# EAGLE design MainControll (EAGLE 9.6.2)
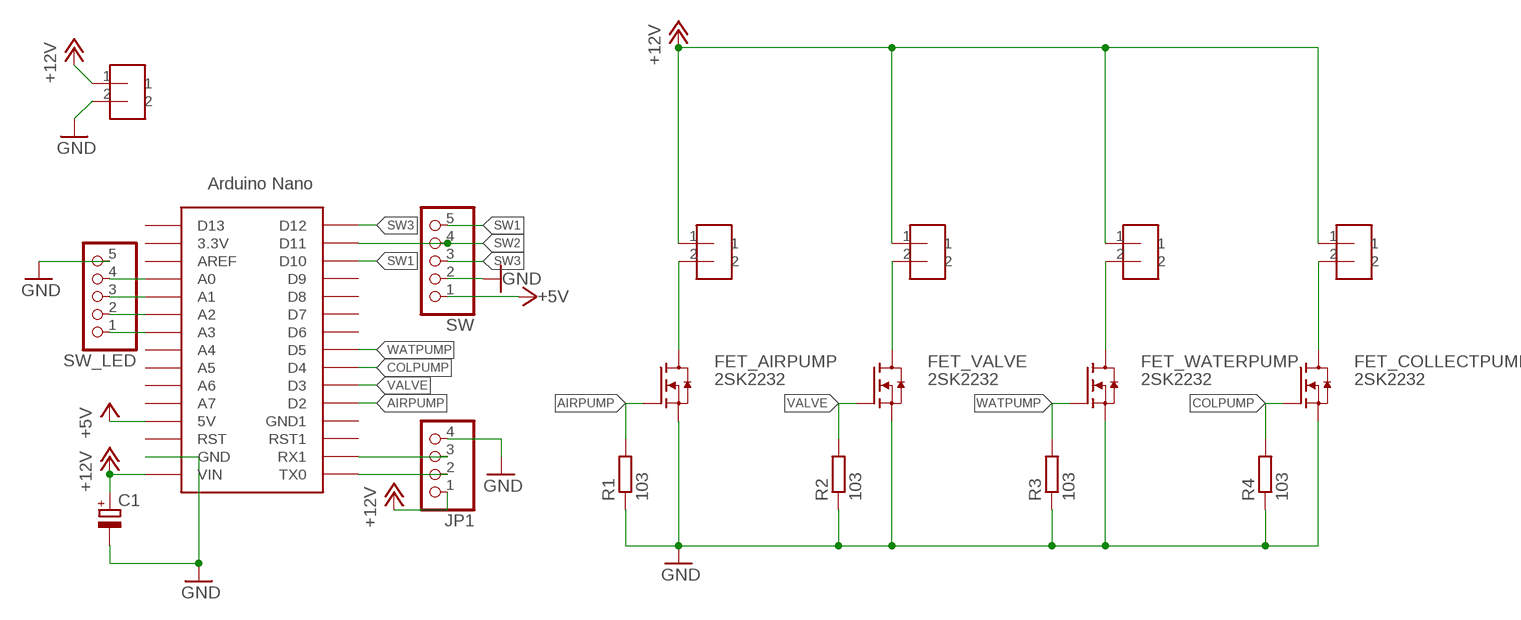
[diagram p0: schematic, sheet 1]

## Parts
C1  CPOL-EUE2.5-5  [E2,5-5]
FET_AIRPUMP  2SK2232  [TO220]
FET_COLLECTPUMP  2SK2232  [TO220]
FET_VALVE  2SK2232  [TO220]
FET_WATERPUMP  2SK2232  [TO220]
JP1  PINHD-1X4  [1X04]
R1  103  R-EU_0204/5  [0204/5]
R2  103  R-EU_0204/5  [0204/5]
R3  103  R-EU_0204/5  [0204/5]
R4  103  R-EU_0204/5  [0204/5]
SW  PINHD-1X5  [1X05]
SW_LED  PINHD-1X5  [1X05]
TERMINAL_AIRPUMP  TERMINAL_BLOCK_5.08MM  [TERMINAL_BLOCK_5.8MM]
TERMINAL_COLLECTPUMP  TERMINAL_BLOCK_5.08MM  [TERMINAL_BLOCK_5.8MM]
TERMINAL_VALVE  TERMINAL_BLOCK_5.08MM  [TERMINAL_BLOCK_5.8MM]
TERMINAL_WATERPUMP  TERMINAL_BLOCK_5.08MM  [TERMINAL_BLOCK_5.8MM]
U$1  TERMINAL_BLOCK_5.08MM  [TERMINAL_BLOCK_5.8MM]
U$2  NANO_DIL_RECEPTOR  [NANO_DIL]

## Nets
+5V: SW.1 U$2.5V
+12V [vcc_gnd]: C1.+ JP1.1 TERMINAL_AIRPUMP.1 TERMINAL_COLLECTPUMP.1 TERMINAL_VALVE.1 TERMINAL_WATERPUMP.1 U$1.1 U$2.VIN
AIRPUMP: FET_AIRPUMP.1(G) R1.2 U$2.D2
COLPUMP: FET_COLLECTPUMP.1(G) R4.2 U$2.D4
GND [vcc_gnd]: C1.- FET_AIRPUMP.3(S) FET_COLLECTPUMP.3(S) FET_VALVE.3(S) FET_WATERPUMP.3(S) JP1.4 R1.1 R2.1 R3.1 R4.1 SW.2 SW_LED.5 U$1.2 U$2.GND
N$1: JP1.3 U$2.RX1
N$2: JP1.2 U$2.TX0
N$7: FET_AIRPUMP.2(D) TERMINAL_AIRPUMP.2
N$8: FET_VALVE.2(D) TERMINAL_VALVE.2
N$9: FET_WATERPUMP.2(D) TERMINAL_WATERPUMP.2
N$10: FET_COLLECTPUMP.2(D) TERMINAL_COLLECTPUMP.2
N$11: SW_LED.4 U$2.A0
N$12: SW_LED.3 U$2.A1
N$13: SW_LED.2 U$2.A2
N$14: SW_LED.1 U$2.A3
SW1: SW.5 U$2.D10
SW2: SW.4 U$2.D11
SW3: SW.3 U$2.D12
VALVE: FET_VALVE.1(G) R2.2 U$2.D3
WATPUMP: FET_WATERPUMP.1(G) R3.2 U$2.D5
Unconnected: U$2.3.3V U$2.A4 U$2.A5 U$2.A6 U$2.A7 U$2.AREF U$2.D6 U$2.D7 U$2.D8 U$2.D9 U$2.D13 U$2.GND1 U$2.RST U$2.RST1

## Library data of the parts
C1 = rcl:CPOL-EU: POLARIZED CAPACITOR, European symbol; SPICEPREFIX: C
FET_AIRPUMP FET_COLLECTPUMP FET_VALVE FET_WATERPUMP = Transistor-FET:2SK2232
JP1 = pinhead:PINHD-1X4: PIN HEADER
R1-R4 = rcl:R-EU_: RESISTOR, European symbol; SPICEPREFIX: R
SW SW_LED = pinhead:PINHD-1X5: PIN HEADER
TERMINAL_AIRPUMP TERMINAL_COLLECTPUMP TERMINAL_VALVE TERMINAL_WATERPUMP U$1 = terminal_block_5.08mm:TERMINAL_BLOCK_5.08MM
U$2 = Arduino-clone:NANO_DIL_RECEPTOR

## Net classes
0 default: width 0.152 mm, clearance 0.305 mm
1 vcc_gnd: width 0.406 mm, clearance 0.305 mm

## Board
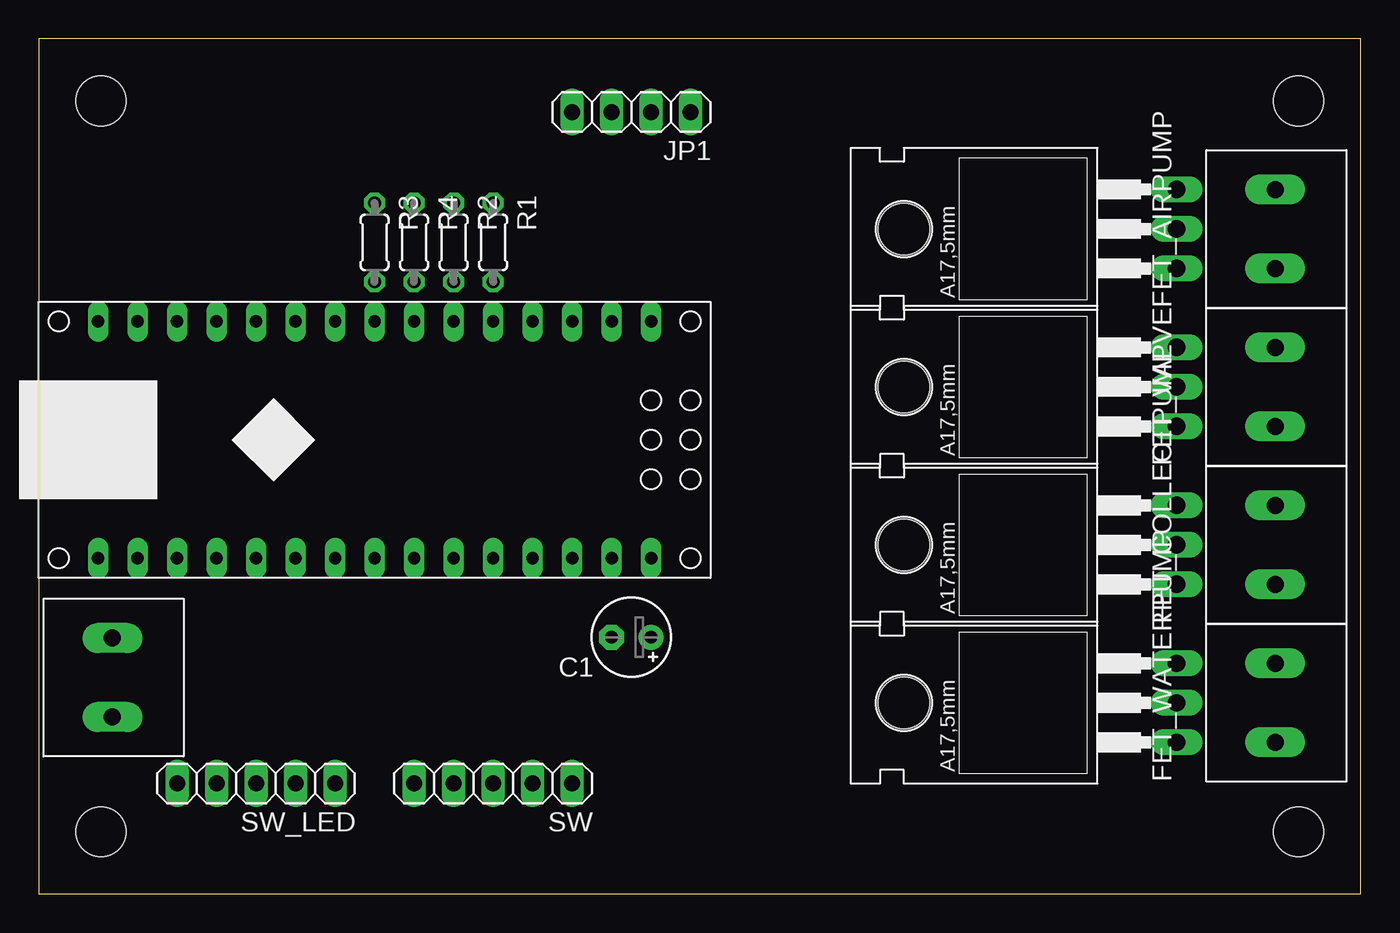
[diagram p1: board, top side]
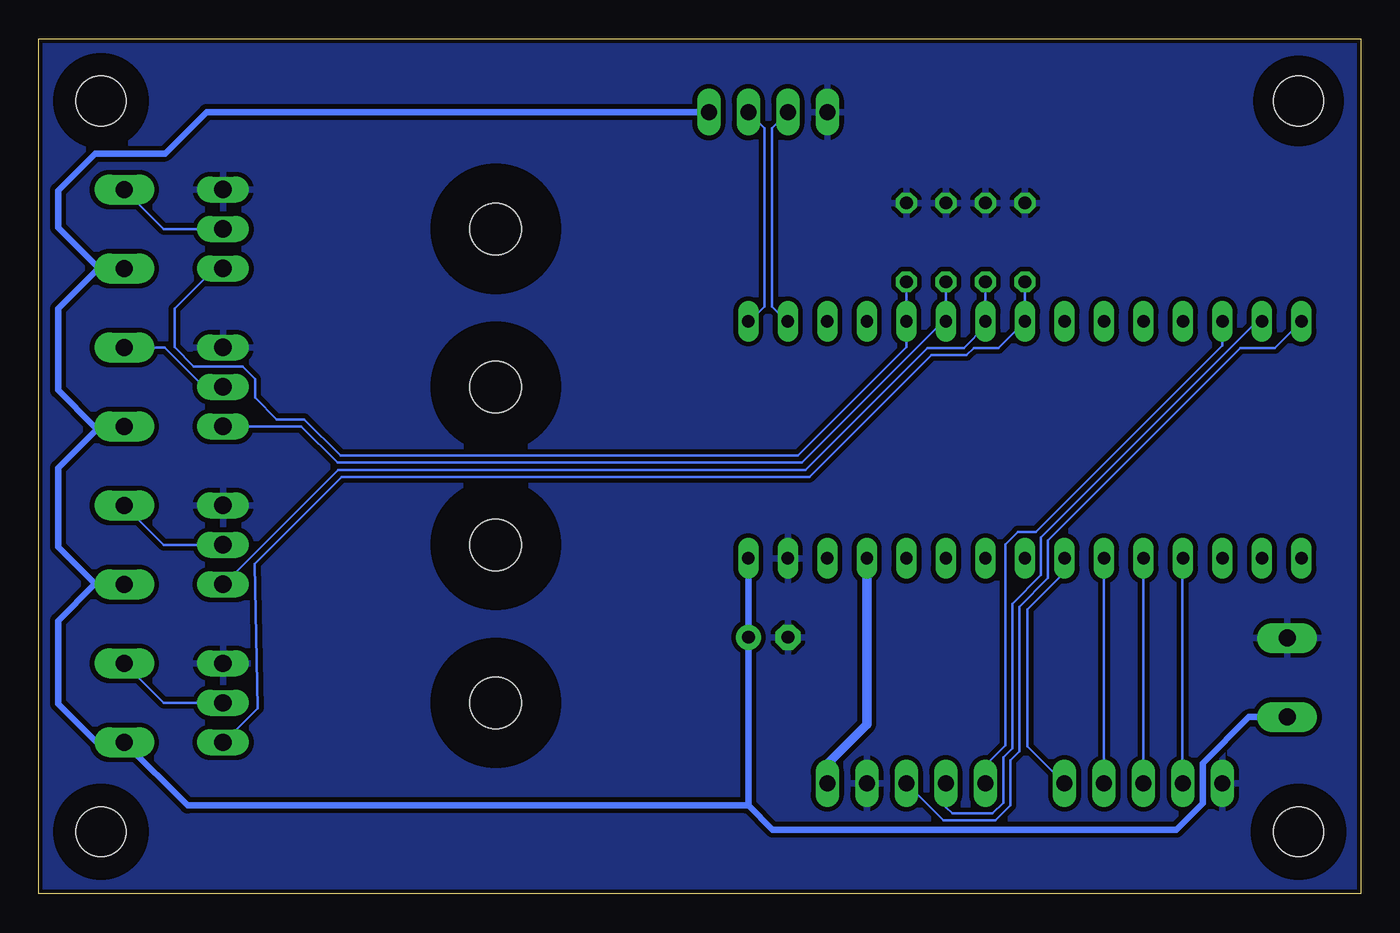
[diagram p2: board, bottom side, seen from below]

Size 85 x 55 mm. Coordinates in mm from the lower left corner, seen from the top.
Outline: 0,0 85,0 85,55 0,55 0,0
Copper layers (1*16): Top 0.035mm / dielectric 1.53mm / Bottom 0.035mm
Design rules "default_10mil *": minimum track width 6mil, minimum drill 0.3mm, track to track 12mil, track to pad 12mil, pad to pad 12mil, via to via 12mil, smd to smd 12mil, copper to edge 10mil, drill to drill 4mil, minimum pad ring 10mil, minimum via ring 8mil, stop-mask expansion 4mil, vias tented up to drill 0mil, thermal gap 12mil
Holes 3.2 mm at 4,51 4,4 81,4 81,51
bRestrict: area 1,1 to 7,7; area 1.2,48.2 to 6.8,53.8; area 78,48 to 84,54; area 78,1 to 84,7

### Footprints (pad centres in the part's own frame; a part is rotated, then mirrored left to right if it is on the bottom)
E2,5-5 = drill 0.813 pad 1.6: + -1.27,0 | drill 0.813 pad 1.6 octagon: - 1.27,0
TO220 = drill 1.118 long: 1 -2.54,-6.35; 2 0,-6.35; 3 2.54,-6.35 | hole 3.302: 0,11.176
1X04 = drill 1.016 long: 1 -3.81,0; 2 -1.27,0; 3 1.27,0; 4 3.81,0
0204/5 = drill 0.813 octagon: 1 -2.54,0; 2 2.54,0
1X05 = drill 1.016 long: 1 -5.08,0; 2 -2.54,0; 3 0,0; 4 2.54,0; 5 5.08,0
TERMINAL_BLOCK_5.8MM = drill 1.1 pad 1.93 long: 1 0,0; 2 5.08,0
NANO_DIL = drill 0.8 long: 3.3V -7.62,15.24; 5V -7.62,-10.16; A0 -7.62,10.16; A1 -7.62,7.62; A2 -7.62,5.08; A3 -7.62,2.54; A4 -7.62,0; A5 -7.62,-2.54; A6 -7.62,-5.08; A7 -7.62,-7.62; AREF -7.62,12.7; D2 7.62,-7.62; D3 7.62,-5.08; D4 7.62,-2.54; D5 7.62,0; D6 7.62,2.54; D7 7.62,5.08; D8 7.62,7.62; D9 7.62,10.16; D10 7.62,12.7; D11 7.62,15.24; D12 7.62,17.78; D13 -7.62,17.78; GND -7.62,-15.24; GND1 7.62,-10.16; RST -7.62,-12.7; RST1 7.62,-12.7; RX1 7.62,-15.24; TX0 7.62,-17.78; VIN -7.62,-17.78

### Placement (x,y rotation side)
C1  38.1,16.51 180 top
FET_AIRPUMP  66.8,42.77 90 top
FET_COLLECTPUMP  66.8,22.45 90 top
FET_VALVE  66.8,32.61 90 top
FET_WATERPUMP  66.8,12.29 90 top
JP1  38.1,50.29 180 top
R1  29.21,41.91 270 top
R2  26.67,41.91 270 top
R3  21.59,41.91 270 top
R4  24.13,41.91 270 top
SW  29.21,7.11 180 top
SW_LED  13.97,7.11 180 top
TERMINAL_AIRPUMP  79.5,40.23 90 top
TERMINAL_COLLECTPUMP  79.5,19.91 90 top
TERMINAL_VALVE  79.5,30.07 90 top
TERMINAL_WATERPUMP  79.5,9.75 90 top
U$1  4.72,11.38 90 top
U$2  21.59,29.21 90 top

### Tracks (layer width: path | path; a pad name or v marks a point on that pad's centre or on a via)
+5V
  Bottom 0.61: SW.1 34.29,8.38 31.75,10.92 U$2.5V
+12V
  Bottom 0.406: U$1.1 7.18,11.38 10.16,8.4 10.16,5.82 11.84,4.14 37.82,4.14 39.37,5.69 39.52,5.69 | C1.+ 39.6,16.28 | C1.+ U$2.VIN | 39.52,5.69 75.44,5.69 TERMINAL_WATERPUMP.1 81.28,9.75 83.77,12.24 83.77,17.58 81.43,19.91 TERMINAL_COLLECTPUMP.1 81.36,19.91 83.77,22.33 83.77,27.41 81.1,30.07 TERMINAL_VALVE.1 81.43,30.07 83.77,32.41 83.77,37.64 81.18,40.23 TERMINAL_AIRPUMP.1 81.13,40.23 83.77,42.88 83.77,45.24 81.38,47.62 76.89,47.62 74.22,50.29 JP1.1 | 39.52,5.69 39.37,5.84 C1.+
AIRPUMP
  Bottom 0.152: R1.2 U$2.D2 29.21,35.18 36.2,28.19 65.6,28.19 67.93,30.53 69.7,30.53 71.09,31.93 71.09,33.12 71.91,33.93 75.03,33.93 76.28,35.18 76.28,37.64 73.69,40.23 FET_AIRPUMP.1
COLPUMP
  Bottom 0.152: R4.2 U$2.D4 24.13,36.52 25.53,35.13 27.86,35.13 35.71,27.28 65.76,27.28 73.13,19.91 FET_COLLECTPUMP.1
GND
  pour Bottom: 0,55.22 85.29,55.22 85.29,0 0,0
N$1
  Bottom 0.152: JP1.3 37.87,49.25 37.87,37.8 36.91,36.83 U$2.RX1
N$2
  Bottom 0.152: JP1.2 38.33,49.25 38.33,37.8 39.29,36.83 U$2.TX0
N$7
  Bottom 0.152: FET_AIRPUMP.2 76.96,42.77 TERMINAL_AIRPUMP.2
N$8
  Bottom 0.152: FET_VALVE.2 74.37,32.61 76.91,35.15 TERMINAL_VALVE.2
N$9
  Bottom 0.152: FET_WATERPUMP.2 76.96,12.29 TERMINAL_WATERPUMP.2
N$10
  Bottom 0.152: FET_COLLECTPUMP.2 76.96,22.45 TERMINAL_COLLECTPUMP.2
N$11
  Bottom 0.152: U$2.A0 11.46,21.57 11.46,7.14 SW_LED.4
N$12
  Bottom 0.152: U$2.A1 SW_LED.3
N$13
  Bottom 0.152: U$2.A2 SW_LED.2
N$14
  Bottom 0.152: U$2.A3 19.05,20.68 21.44,18.29 21.44,9.5 SW_LED.1
SW1
  Bottom 0.152: U$2.D10 8.89,35.28 20.88,23.29 22.05,23.29 22.86,22.48 22.86,9.55 24.13,8.28 SW.5
SW2
  Bottom 0.152: SW.4 26.67,5.59 26.26,5.18 23.68,5.18 22.99,5.88 22.99,8.78 22.4,9.36 22.4,18.66 20.55,20.51 20.55,22.94 6.67,36.83 U$2.D11
SW3
  Bottom 0.152: U$2.D12 5.51,35.13 7.72,35.13 20.1,22.75 20.1,20.32 21.95,18.47 21.95,9.17 22.53,8.59 22.53,5.69 23.49,4.72 26.82,4.72 SW.3
VALVE
  Bottom 0.152: R2.2 U$2.D3 26.85,36.83 35.94,27.74 65.79,27.74 68.12,30.07 FET_VALVE.1
WATPUMP
  Bottom 0.152: U$2.D5 R3.2 | U$2.D5 21.59,36.42 | FET_WATERPUMP.1 73.13,9.75 70.93,11.95 71.11,21.24 65.53,26.82 35.46,26.82 27.61,34.67 25.34,34.67 24.88,35.13 23.29,35.13 U$2.D5